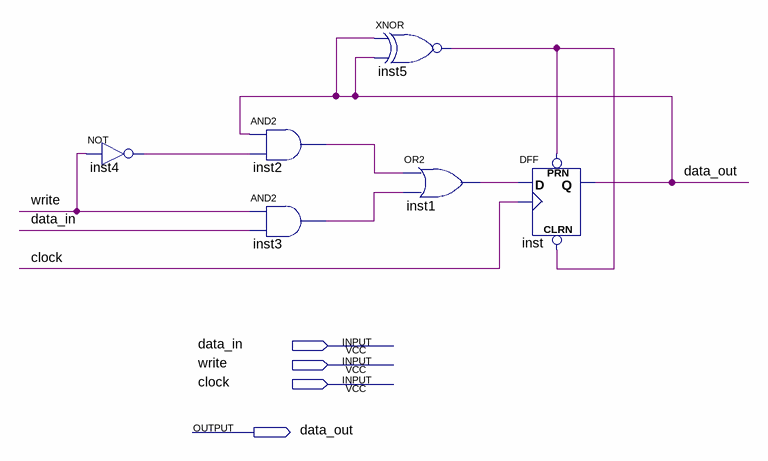
[diagram p0: schematic sheet]
// Quartus schematic reg_1_bit.bdf as structural Verilog: 6 symbols, 4 pins
module reg_1_bit (
  input  data_in,
  input  write,
  input  clock,
  output data_out
);

  wire inst1_out, inst2_out, inst3_out, inst4_out, inst5_out;

  not inst4 (inst4_out, write);
  and inst2 (inst2_out, data_out, inst4_out);
  and inst3 (inst3_out, write, data_in);
  xnor inst5 (inst5_out, data_out, data_out);
  or inst1 (inst1_out, inst2_out, inst3_out);
  DFF inst (.CLRN(inst5_out), .CLK(clock), .D(inst1_out), .PRN(inst5_out), .Q(data_out));
endmodule
